# Altium schematic sheet USB CONN.SchDoc: USB-ETH
size A2; DrawnBy: Luca Schenetti; Revision: C; SheetNumber: 3; SheetTotal: 4
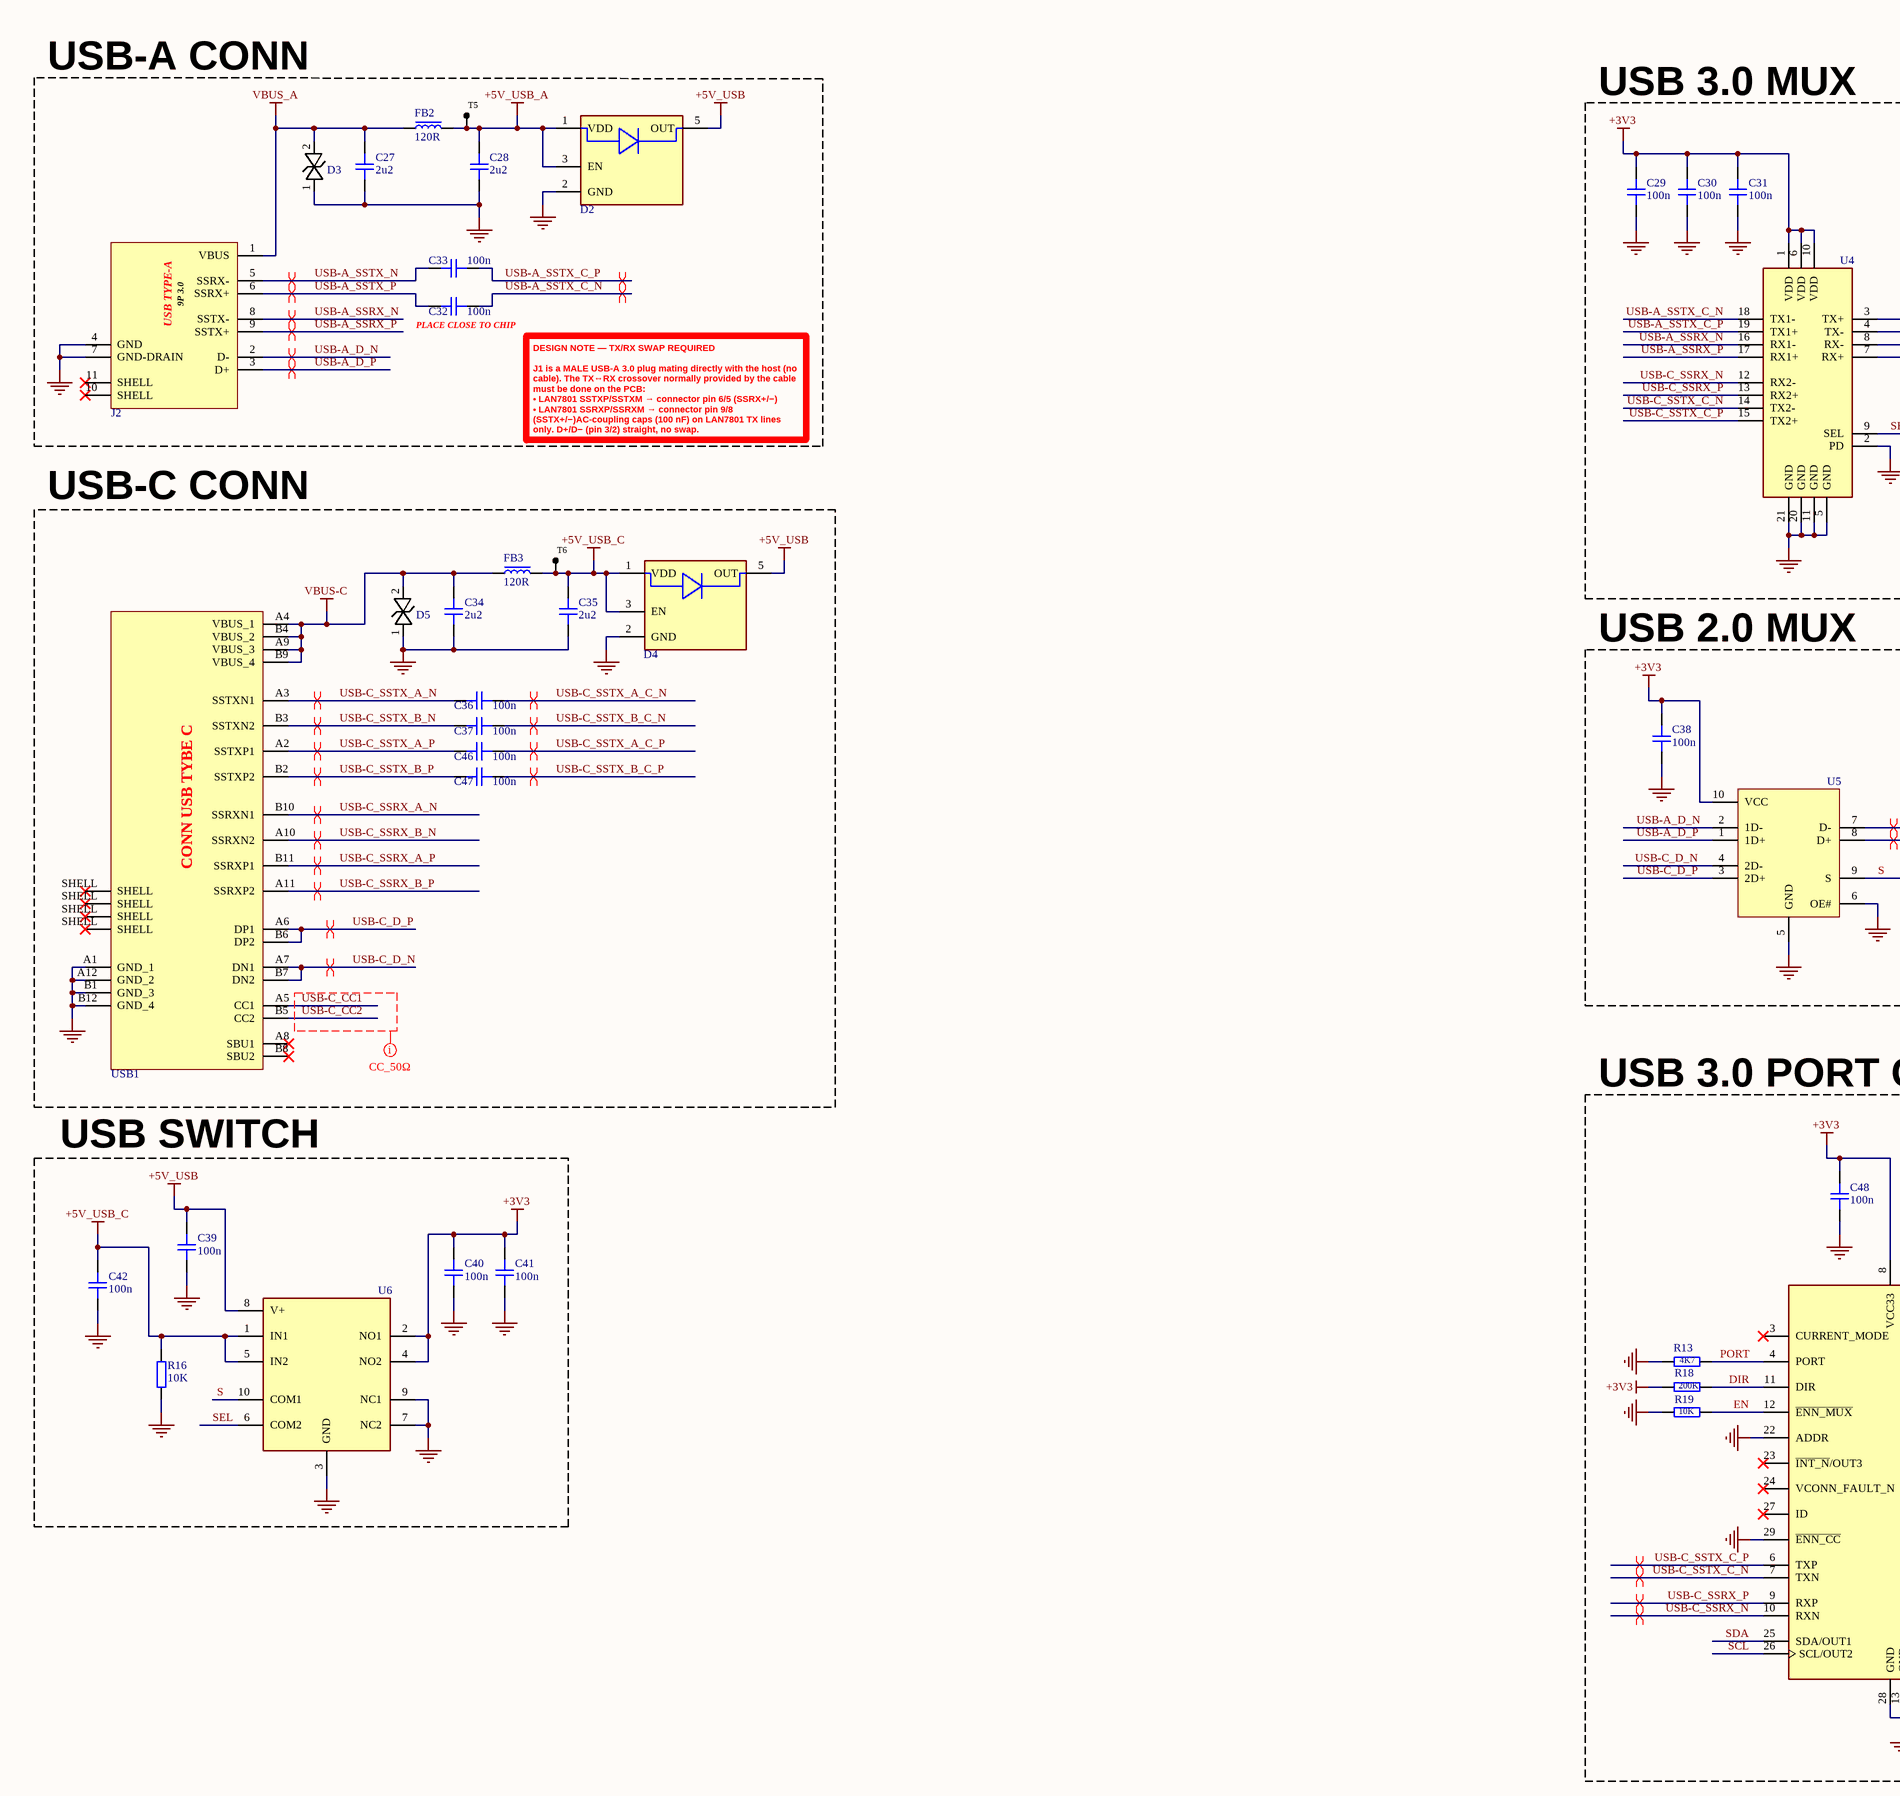
[diagram p0: USB CONN.SchDoc, left]
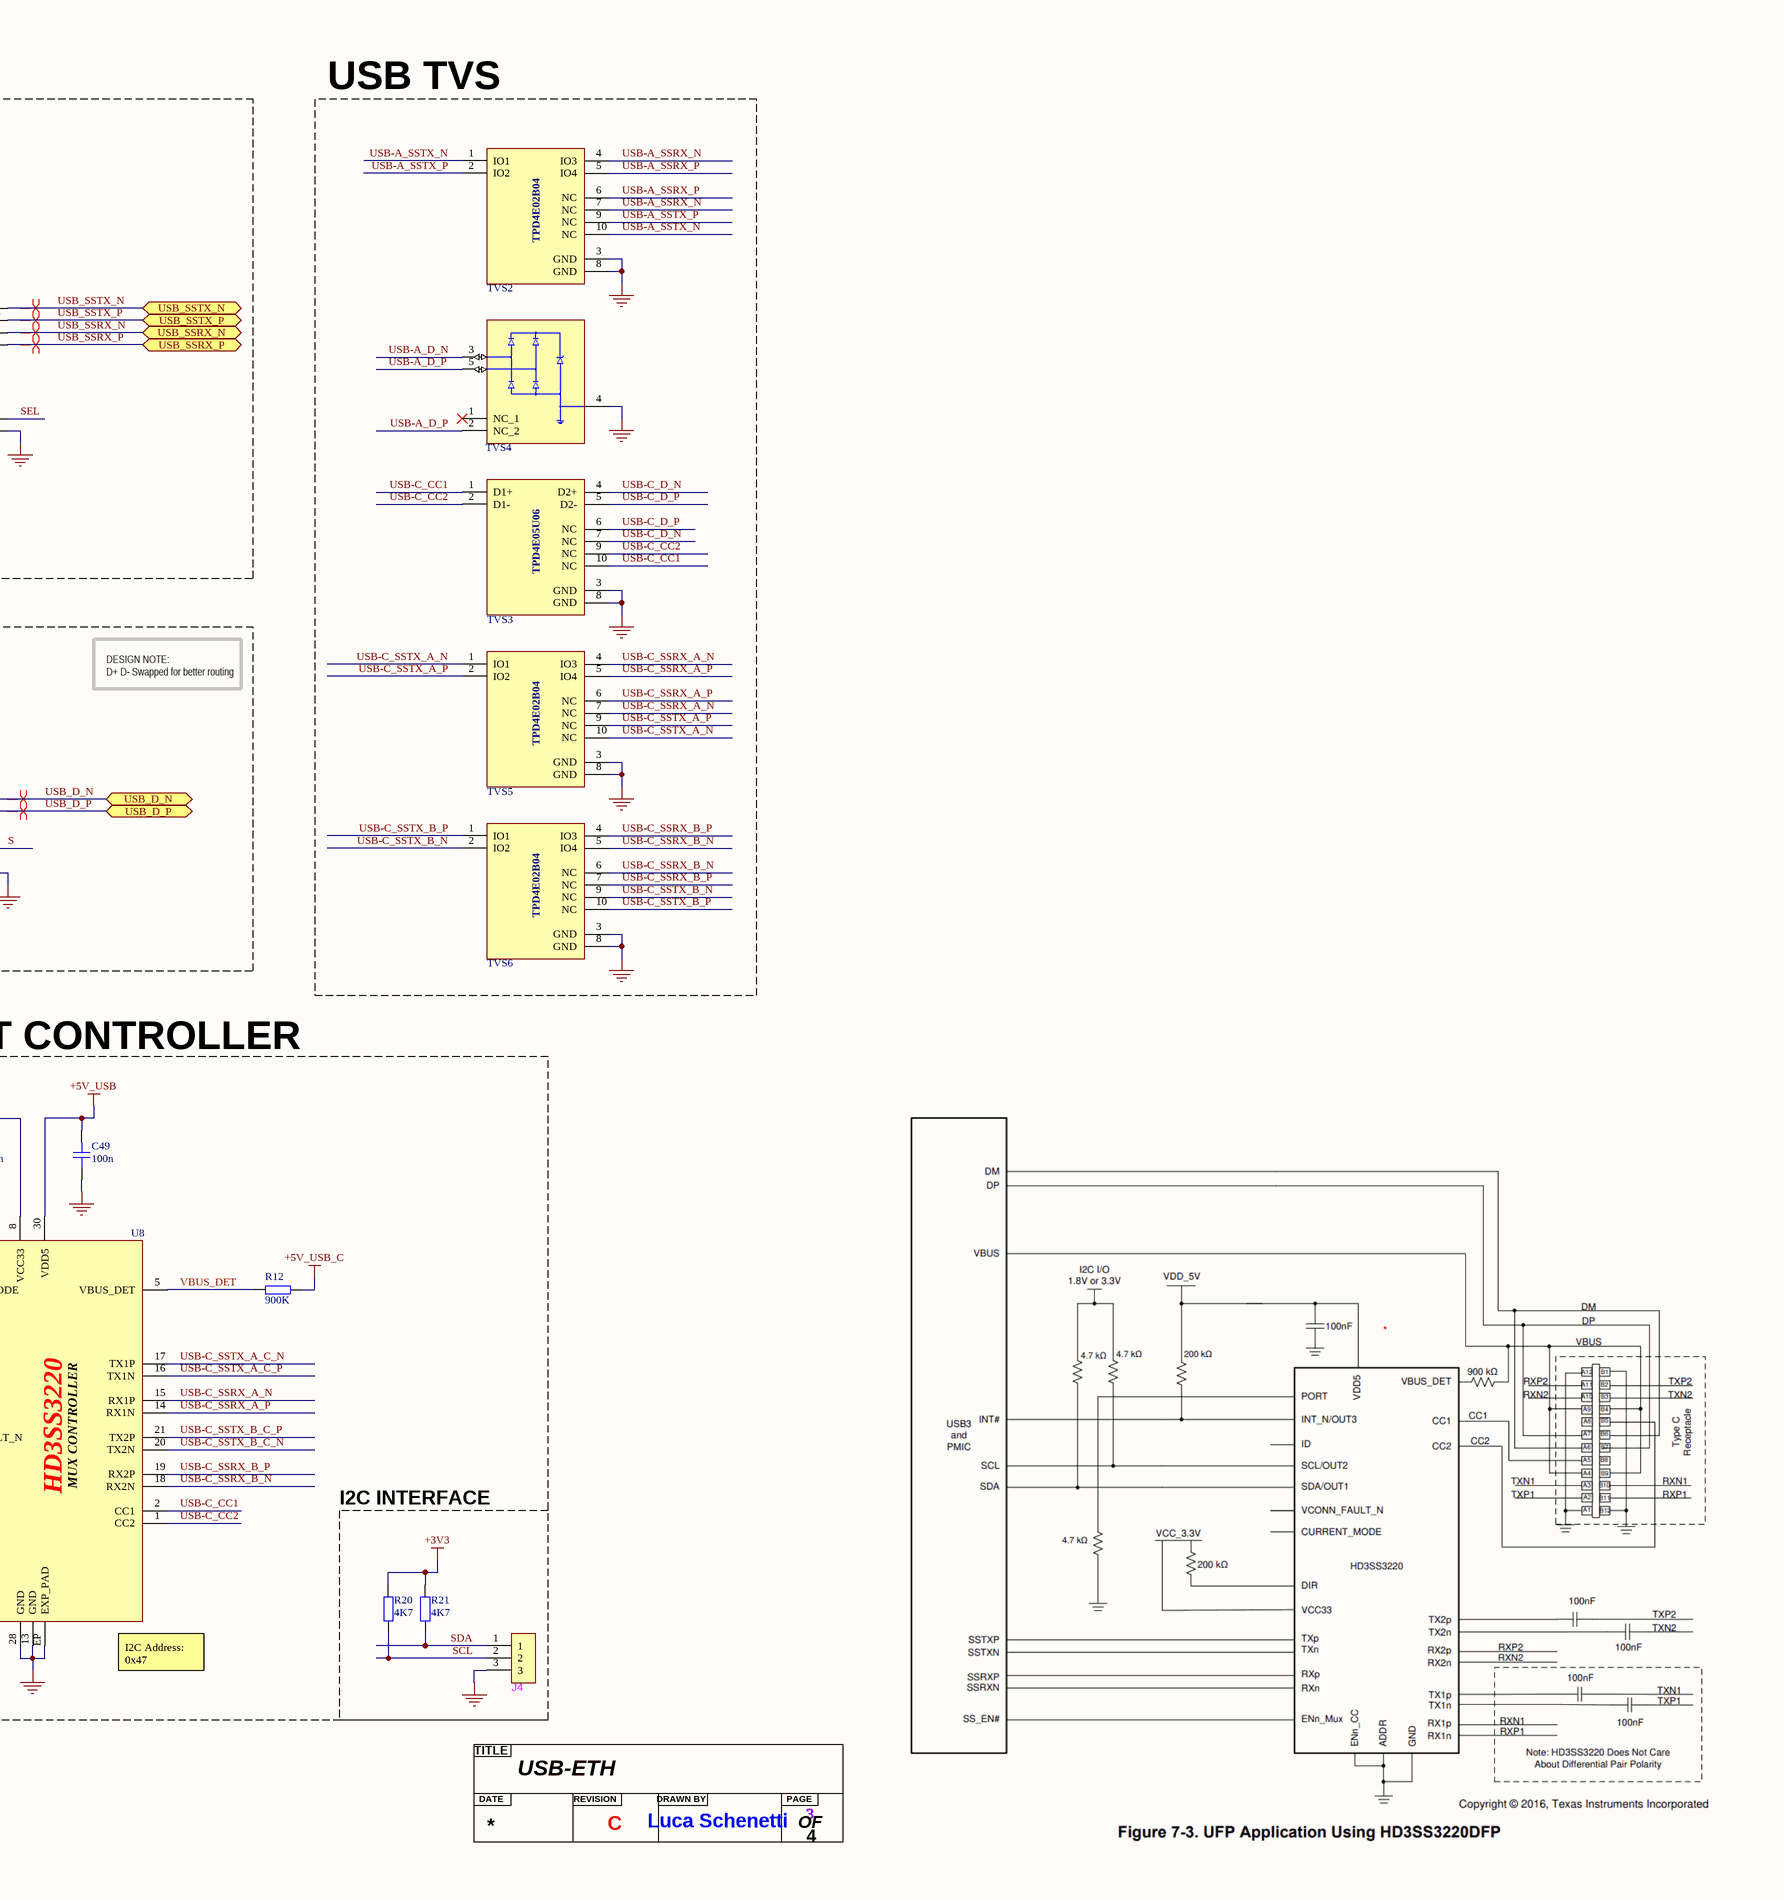
[diagram p1: USB CONN.SchDoc, right]

## Parts
?  Title  (value not drawn)  (graphical)
C27  2u2  [CAP_0402]
C28  2u2  [CAP_0402]
C29  100n  [CAP_0402]
C30  100n  [CAP_0402]
C31  100n  [CAP_0402]
C32  100n  [CAP_0402]
C33  100n  [CAP_0402]
C34  2u2  [CAP_0402]
C35  2u2  [CAP_0402]
C36  100n  [CAP_0402]
C37  100n  [CAP_0402]
C38  100n  [CAP_0402]
C39  100n  [CAP_0402]
C40  100n  [CAP_0402]
C41  100n  [CAP_0402]
C42  100n  [CAP_0402]
C46  100n  [CAP_0402]
C47  100n  [CAP_0402]
C48  100n  [CAP_0402]
C49  100n  [CAP_0402]
D2  IDEAL DIODE 1A  [MAX40200AUK+T]  (value not drawn)
D3  ESD Protection TVS 6.0V  [SMF6.0CA]  (value not drawn)
D4  IDEAL DIODE 1A  [MAX40200AUK+T]  (value not drawn)
D5  ESD Protection TVS 6.0V  [SMF6.0CA]  (value not drawn)
FB2  120R  [FB_0402]
FB3  120R  [FB_0402]
J2  USB-A MALE 9P  [HC-USB3.0-C26]  (value not drawn)
J4  2.54mm 3P  [2.54mm 3P]  (value not drawn)  (no BOM)
R12  900K  [RES_0805]
R13  4K7  [RES_0402]
R16  10K  [RES_0603]
R18  200K  [RES_0402]
R19  10K  [RES_0402]
R20  4K7  [RES_0402]
R21  4K7  [RES_0402]
T5  TP_S  [TP 1mm]  (value not drawn)  (no BOM)
T6  TP_S  [TP 1mm]  (value not drawn)  (no BOM)
TVS2  TVS DIODE USB 3  [TPD4E02B04DQAR]  (value not drawn)
TVS3  ESD and Surge Protection USB, HDMI & High Speed  [TPD4E05U06DQAR]  (value not drawn)
TVS4  TVS USB 2.0 ±25-kV  [TPD2E2U06DRLR]  (value not drawn)
TVS5  TVS DIODE USB 3  [TPD4E02B04DQAR]  (value not drawn)
TVS6  TVS DIODE USB 3  [TPD4E02B04DQAR]  (value not drawn)
U4  MUX USB 3.0  [PI3USB302-AZBEX]  (value not drawn)
U5  MUX USB2.0  [TS3USB221ARSER]  (value not drawn)
U6  Analog Switches, Multiplexers  [TS5A23157DGSR]  (value not drawn)
U8  USB Type-C MUX CONTROLLER  [HD3SS3220]  (value not drawn)
USB1  USB-C 24P SMD  [TYPE-C 24P QT 143]  (value not drawn)

## Blocks framed on the sheet
USB-A CONN: C27 C28 C32 C33 D2 D3 FB2 J2 T5
USB 3.0 MUX: C29-C31 U4
USB TVS: TVS2-TVS6
USB-C CONN: C34-C37 C46 C47 D4 D5 FB3 T6 USB1
USB 2.0 MUX: C38 U5
USB 3.0 PORT CONTROLLER: C48 C49 R12 R13 R18 R19 U8
USB SWITCH: C39-C42 R16 U6
I2C INTERFACE: J4 R20 R21

## Ports
USB_D_N (bidir, see USB-ETH CHIP[1B]), USB_D_P (bidir, see USB-ETH CHIP[1B]), USB_SSRX_N (bidir, see USB-ETH CHIP[1B]), USB_SSRX_P (bidir, see USB-ETH CHIP[1B]), USB_SSTX_N (bidir, see USB-ETH CHIP[1B]), USB_SSTX_P (bidir, see USB-ETH CHIP[1B])

## Nets
+3V3: C29.1 C30.1 C31.1 C38.1 C40.1 C41.1 C48.1 R18.1 R20.2 R21.2 U4.1(VDD) U4.6(VDD) U4.10(VDD) U5.10(VCC) U6.2(NO1) U6.4(NO2) U8.8(VCC33)
+5V_USB: C39.1 C49.1 D2.5(OUT) D4.5(OUT) U6.8(V+) U8.30(VDD5)
+5V_USB_A: C28.2 D2.1(VDD) D2.3(EN) FB2.2 T5.1
+5V_USB_C: C35.2 C42.1 D4.1(VDD) D4.3(EN) FB3.2 R12.2 R16.2 T6.1 U6.1(IN1) U6.5(IN2)
GND: C27.1 C28.1 C29.2 C30.2 C31.2 C34.1 C35.1 C38.2 C39.2 C40.2 C41.2 C42.2 C48.2 C49.2 D2.2(GND) D3.1 D4.2(GND) D5.1 J2.4(GND) J2.7(GND-DRAIN) J4.3 R13.2 R16.1 R19.1 TVS2.3(GND) TVS2.8(GND) TVS3.3(GND) TVS3.8(GND) TVS4.4(GND) TVS5.3(GND) TVS5.8(GND) TVS6.3(GND) TVS6.8(GND) U4.2(PD) U4.5(GND) U4.11(GND) U4.20(GND) U4.21(GND) U5.5(GND) U5.6(OE#) U6.3(GND) U6.7(NC2) U6.9(NC1) U8.13(GND) U8.22(ADDR) U8.28(GND) U8.29(~{ENN_CC}) U8.EP(EXP_PAD) USB1.A1(GND_1) USB1.A12(GND_2) USB1.B1(GND_3) USB1.B12(GND_4)
VBUS-C: C34.2 D5.2 FB3.1 USB1.A4(VBUS_1) USB1.A9(VBUS_3) USB1.B4(VBUS_2) USB1.B9(VBUS_4)
VBUS_A: C27.2 D3.2 FB2.1 J2.1(VBUS)
DIR: R18.2 U8.11(DIR)
EN: R19.2 U8.12(~{ENN_MUX})
PORT: R13.1 U8.4(PORT)
S: U5.9(S) U6.10(COM1)
SCL: J4.2 R20.1 U8.26(SCL/OUT2)
SDA: J4.1 R21.1 U8.25(SDA/OUT1)
SEL: U4.9(SEL) U6.6(COM2)
USB-A_D_N: J2.2(D-) TVS4.3(IO1) U5.2(1D-)
USB-A_D_P: J2.3(D+) TVS4.2(NC_2) TVS4.5(IO2) U5.1(1D+)
USB-A_SSRX_N: J2.8(SSTX-) TVS2.4(IO3) TVS2.7(NC) U4.16(RX1-)
USB-A_SSRX_P: J2.9(SSTX+) TVS2.5(IO4) TVS2.6(NC) U4.17(RX1+)
USB-A_SSTX_C_N: C32.2 U4.18(TX1-)
USB-A_SSTX_C_P: C33.2 U4.19(TX1+)
USB-A_SSTX_N: C33.1 J2.5(SSRX-) TVS2.1(IO1) TVS2.10(NC)
USB-A_SSTX_P: C32.1 J2.6(SSRX+) TVS2.2(IO2) TVS2.9(NC)
USB-C_CC1: TVS3.1(D1+) TVS3.10(NC) U8.2(CC1) USB1.A5(CC1)
USB-C_CC2: TVS3.2(D1-) TVS3.9(NC) U8.1(CC2) USB1.B5(CC2)
USB-C_D_N: TVS3.4(D2+) TVS3.7(NC) U5.4(2D-) USB1.A7(DN1) USB1.B7(DN2)
USB-C_D_P: TVS3.5(D2-) TVS3.6(NC) U5.3(2D+) USB1.A6(DP1) USB1.B6(DP2)
USB-C_SSRX_A_N: TVS5.4(IO3) TVS5.7(NC) U8.15(RX1P) USB1.B10(SSRXN1)
USB-C_SSRX_A_P: TVS5.5(IO4) TVS5.6(NC) U8.14(RX1N) USB1.B11(SSRXP1)
USB-C_SSRX_B_N: TVS6.5(IO4) TVS6.6(NC) U8.18(RX2N) USB1.A10(SSRXN2)
USB-C_SSRX_B_P: TVS6.4(IO3) TVS6.7(NC) U8.19(RX2P) USB1.A11(SSRXP2)
USB-C_SSRX_N: U4.12(RX2-) U8.10(RXN)
USB-C_SSRX_P: U4.13(RX2+) U8.9(RXP)
USB-C_SSTX_A_C_N: C36.2 U8.17(TX1P)
USB-C_SSTX_A_C_P: C46.2 U8.16(TX1N)
USB-C_SSTX_A_N: C36.1 TVS5.1(IO1) TVS5.10(NC) USB1.A3(SSTXN1)
USB-C_SSTX_A_P: C46.1 TVS5.2(IO2) TVS5.9(NC) USB1.A2(SSTXP1)
USB-C_SSTX_B_C_N: C37.2 U8.20(TX2N)
USB-C_SSTX_B_C_P: C47.2 U8.21(TX2P)
USB-C_SSTX_B_N: C37.1 TVS6.2(IO2) TVS6.9(NC) USB1.B3(SSTXN2)
USB-C_SSTX_B_P: C47.1 TVS6.1(IO1) TVS6.10(NC) USB1.B2(SSTXP2)
USB-C_SSTX_C_N: U4.14(TX2-) U8.7(TXN)
USB-C_SSTX_C_P: U4.15(TX2+) U8.6(TXP)
USB_D_N: U5.7(D-) ; port USB_D_N
USB_D_P: U5.8(D+) ; port USB_D_P
USB_SSRX_N: U4.8(RX-) ; port USB_SSRX_N
USB_SSRX_P: U4.7(RX+) ; port USB_SSRX_P
USB_SSTX_N: U4.3(TX+) ; port USB_SSTX_N
USB_SSTX_P: U4.4(TX-) ; port USB_SSTX_P
VBUS_DET: R12.1 U8.5(VBUS_DET)

Not connected (* = marked no-connect by the designer): J2 10(SHELL)* 11(SHELL)*; TVS4 1(NC_1)*; U8 3(CURRENT_MODE)* 23(~{INT_N}/OUT3)* 24(VCONN_FAULT_N)* 27(ID)*; USB1 A8(SBU1)* B8(SBU2)* SHELL*

## Layout directives
differential pair; differential pair class DIFF_USB_90Ω: USB-A_D_N, USB-A_D_P, USB-A_SSRX_N, USB-A_SSRX_P, USB-A_SSTX_C_N, USB-A_SSTX_C_P, USB-A_SSTX_N, USB-A_SSTX_P, USB-C_D_N, USB-C_D_P, USB-C_SSRX_A_N, USB-C_SSRX_A_P, USB-C_SSRX_B_N, USB-C_SSRX_B_P, USB-C_SSRX_N, USB-C_SSRX_P, USB-C_SSTX_A_C_N, USB-C_SSTX_A_C_P, USB-C_SSTX_A_N, USB-C_SSTX_A_P, USB-C_SSTX_B_C_N, USB-C_SSTX_B_C_P, USB-C_SSTX_B_N, USB-C_SSTX_B_P, USB-C_SSTX_C_N, USB-C_SSTX_C_P, USB_D_N, USB_D_P, USB_SSRX_N, USB_SSRX_P, USB_SSTX_N, USB_SSTX_P
net class CC_50Ω: USB-C_CC1, USB-C_CC2

## Notes on the sheet
- (near C32) PLACE CLOSE TO CHIP
- DESIGN NOTE — TX/RX SWAP REQUIRED
  J1 is a MALE USB-A 3.0 plug mating directly with the host (no cable). The TX↔RX crossover normally provided by the cable must be done on the PCB:
  • LAN7801 SSTXP/SSTXM → connector pin 6/5 (SSRX+/−)
  • LAN7801 SSRXP/SSRXM → connector pin 9/8 (SSTX+/−)AC-coupling caps (100 nF) on LAN7801 TX lines only. D+/D− (pin 3/2) straight, no swap.
- DESIGN NOTE:
  D+ D- Swapped for better routing
- (near U8) I2C Address:
  0x47
- (in symbol HC-USB3.0-C26) USB TYPE-A; 9P 3.0
- (in symbol HD3SS3220RNHR) HD3SS3220; MUX CONTROLLER
- (in symbol Title) TITLE; DATE; REVISION; DRAWN BY; PAGE; OF
- (in symbol TPD4E02B04DQAR) TPD4E02B04
- (in symbol TPD4E05U06DQAR) TPD4E05U06
- (in symbol USB-C 24P) CONN USB TYBE C

## Library data of the parts
C27 C28 C34 C35 = CAP_0402: [C12530]; Manufacturer: *; Manufacturer Part Number: *; Distributor Link: *; LCSC: *; Rating: *; Dielectric: *
C29-C31 C38-C42 = CAP_0402: [C307331]; Manufacturer: *; Manufacturer Part Number: *; Distributor Link: *; LCSC: *; Rating: *; Dielectric: *
C32 C33 C36 C37 C46 C47 = CAP_0402: Capacitor SMD 0402[C1525]; Manufacturer: *; Manufacturer Part Number: *; Distributor Link: *; LCSC: *; Rating: *; Dielectric: *
C48 C49 = CAP_0402: C307331; Manufacturer: *; Manufacturer Part Number: *; Distributor Link: *; LCSC: *; Rating: *; Dielectric: *
D2 D4 = MAX40200AUK+T: [C2649430]
D3 D5 = SMF6.0CA: [C123791]
FB2 FB3 = FB_0402: [C76891]; Manufacturer: *; Manufacturer Part Number: *; Distributor Link: *; LCSC: *
J2 = HC-USB3.0-C26: [C7501854]
J4 = 2.54mm 3P: [C6332196]; Manufacturer: HANBO(汉博); Symbol: HB-PH3-25413PB2GOP; Add into BOM: yes; Pin Structure: 1x3P; Circluar Pins/Square Pins: Square Pins; Current Rating (Max): 3A; Voltage Rating (Max): 250V; Soldering Temperature(Max): 260℃; Device: HB-PH3-25413PB2GOP; LCSC Part Name: 间距:2.54mm 1x3P 直插 方针; Supplier Part: C6332196; Manufacturer Part: HB-PH3-25413PB2GOP; Supplier Footprint: 插件,P=2.54mm; JLCPCB Part Class: Extended Part; Datasheet: https://atta.szlcsc.com/upload/public/pdf/source/20230803/F72D259687963761DF1B552F3BB84A31.pdf; Supplier: LCSC; Convert to PCB: yes; Pitch: 2.54mm; Row Spacing: 2.54mm; Mounting Type: Straight; Number of Rows: Plugin; Number of Pins: 3P; Length of Mating Pin: 6mm; Insulation Height: 2.54mm; Length of End Connection Pin: 3mm; Contact Plating: Gold; Operating Temperature Range: -40℃~+105℃; Color: Black
R12 = RES_0805: [C52209984]; Manufacturer: *; Manufacturer Part Number: *; Distributor Link: *; LCSC: *
R13 R20 R21 = RES_0402: [C25900]; Manufacturer: *; Manufacturer Part Number: *; Distributor Link: *; LCSC: *
R16 = RES_0603: [C25804]; Manufacturer: *; Manufacturer Part Number: *; Distributor Link: *; LCSC: *
R18 = RES_0402: [C25764]; Manufacturer: *; Manufacturer Part Number: *; Distributor Link: *; LCSC: *
R19 = RES_0402: [C25744]; Manufacturer: *; Manufacturer Part Number: *; Distributor Link: *; LCSC: *
T5 T6 = TP_S: test point
TVS2 TVS5 TVS6 = TPD4E02B04DQAR: [C106794]
TVS3 = TPD4E05U06DQAR: [C138714]
TVS4 = TPD2E2U06DRLR: [C1972959]
U4 = PI3USB302-AZBEX: [C500787]
U5 = TS3USB221ARSER: [C128396]
U6 = TS5A23157DGSR: [C11133]
U8 = HD3SS3220RNHR: [C165155]
USB1 = USB-C 24P: [C5156605]